# EAGLE schematic v5-CPU-Section-temp (EAGLE 7.5.0)
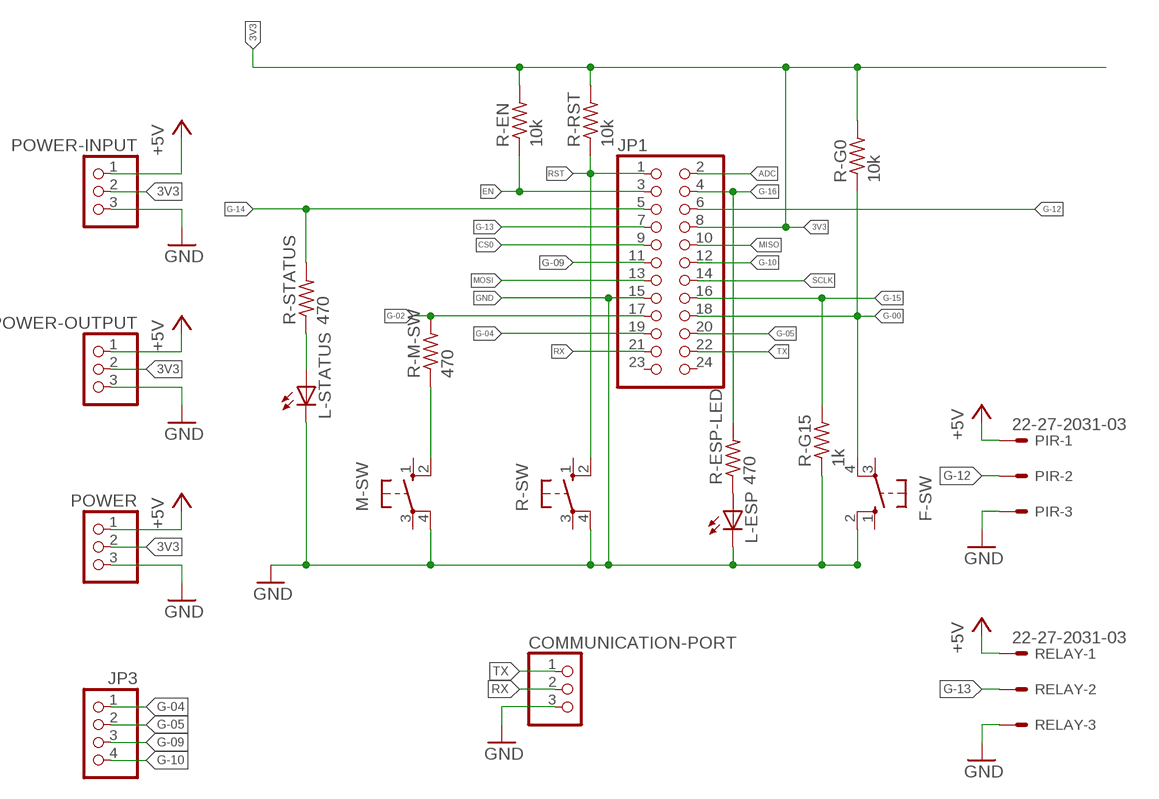
[diagram p0: schematic, sheet 1]

## Parts
COMMUNICATION-PORT  PINHD-1X3  [1X03]
F-SW  10-XX  [B3F-10XX]
JP1  PINHD-2X12  [2X12]
JP3  PINHD-1X4  [1X04]
L-ESP  LED3MM  [LED3MM]
L-STATUS  LED3MM  [LED3MM]
M-SW  10-XX  [B3F-10XX]
PIR  22-27-2031-03  [6410-03]
POWER  PINHD-1X3  [1X03]
POWER-INPUT  PINHD-1X3  [1X03]
POWER-OUTPUT  PINHD-1X3  [1X03]
R-EN  10k  R-US_0207/7  [0207/7]
R-ESP-LED  470  R-US_0207/7  [0207/7]
R-G0  10k  R-US_0207/7  [0207/7]
R-G15  1k  R-US_0207/7  [0207/7]
R-M-SW  470  R-US_0207/7  [0207/7]
R-RST  10k  R-US_0207/7  [0207/7]
R-STATUS  470  R-US_0207/7  [0207/7]
R-SW  10-XX  [B3F-10XX]
RELAY  22-27-2031-03  [6410-03]

## Nets
3V3: JP1.8 POWER-INPUT.2 POWER-OUTPUT.2 POWER.2 R-EN.2 R-G0.2 R-RST.2
+5V: PIR.1 POWER-INPUT.1 POWER-OUTPUT.1 POWER.1 RELAY.1
ADC: JP1.2
CS0: JP1.9
EN: JP1.3 R-EN.1
G-00: F-SW.4(P1) JP1.18 R-G0.1
G-02: JP1.17 R-M-SW.2
G-04: JP1.19 JP3.1
G-05: JP1.20 JP3.2
G-09: JP1.11 JP3.3
G-10: JP1.12 JP3.4
G-12: JP1.6 PIR.2
G-13: JP1.7 RELAY.2
G-14: JP1.5 R-STATUS.2
G-15: JP1.16 R-G15.2
G-16: JP1.4 R-ESP-LED.2
GND: COMMUNICATION-PORT.3 F-SW.2(S1) JP1.15 L-ESP.K(C) L-STATUS.K(C) M-SW.4(P1) PIR.3 POWER-INPUT.3 POWER-OUTPUT.3 POWER.3 R-G15.1 R-SW.4(P1) RELAY.3
MISO: JP1.10
MOSI: JP1.13
N$1: L-STATUS.A R-STATUS.1
N$2: L-ESP.A R-ESP-LED.1
N$11: M-SW.2(S1) R-M-SW.1
RST: JP1.1 R-RST.1 R-SW.2(S1)
RX: COMMUNICATION-PORT.2 JP1.21
SCLK: JP1.14
TX: COMMUNICATION-PORT.1 JP1.22
Unconnected: F-SW.1(S) F-SW.3(P) JP1.23 JP1.24 M-SW.1(S) M-SW.3(P) R-SW.1(S) R-SW.3(P)

## Library data of the parts
COMMUNICATION-PORT POWER POWER-INPUT POWER-OUTPUT = pinhead:PINHD-1X3: PIN HEADER
F-SW M-SW R-SW = switch-omron:10-XX: OMRON SWITCH; MPN: B3F-1000; OC_FARNELL: 176432; OC_NEWARK: 36M3542
JP1 = pinhead:PINHD-2X12: PIN HEADER
JP3 = pinhead:PINHD-1X4: PIN HEADER
L-ESP L-STATUS = led:LED: LED OSRAM: - CHIPLED LG R971, LG N971, LY N971, LG Q971, LY Q971, LO R971, LY R971 LH N974, LH R974 LS Q976, LO Q976, LY Q976 LO Q996 - Hyper CHIPLED LW Q18S LB Q993, LB Q99A, LB R99A - SideLED LS A670, LO A670, LY A670, LG A670, LP A670 LB A673, LV A673, LT A673, LW A673 LH A674 LY A675 LS A676, LA A676, LO A676, LY A676, LW A676 LS A679, LY A679, LG A679 - Hyper Micro SIDELED® LS Y876, LA Y876, LO Y876, LY Y876 LT Y87S - SmartLED LW L88C, LW L88S LB L89C, LB L89S, LG L890 LS L89K, LO L89K, LY L89K LS L896, LA L896, LO L896, LY L896 - TOPLED LS T670, LO T670, LY T670, LG T670, LP T670 LSG T670, LSP T670, LSY T670, LOP T670, LYG T670 LG T671, LOG T671, LSG T671 LB T673, LV T673, LT T673, LW T673 LH T674 LS T676, LA T676, LO T676, LY T676, LB T676, LH T676, LSB T676, LW T676 LB T67C, LV T67C, LT T67C, LS T67K, LO T67K, LY T67K, LW E67C LS E67B, LA E67B, LO E67B, LY E67B, LB E67C, LV E67C, LT E67C LW T67C LS T679, LY T679, LG T679 LS T770, LO T770, LY T770, LG T770, LP T770 LB T773, LV T773, LT T773, LW T773 LH T774 LS E675, LA E675, LY E675, LS T675 LS T776, LA T776, LO T776, LY T776, LB T776 LHGB T686 LT T68C, LB T68C - Hyper Mini TOPLED® LB M676 - Mini TOPLED Santana® LG M470 LS M47K, LO M47K, LY M47K Source: http://www.osram.convergy.de LUXEON: - LUMILED® LXK2-PW12-R00, LXK2-PW12-S00, LXK2-PW14-U00, LXK2-PW14-V00 LXK2-PM12-R00, LXK2-PM12-S00, LXK2-PM14-U00 LXK2-PE12-Q00, LXK2-PE12-R00, LXK2-PE12-S00, LXK2-PE14-T00, LXK2-PE14-U00 LXK2-PB12-K00, LXK2-PB12-L00, LXK2-PB12-M00, LXK2-PB14-N00, LXK2-PB14-P00, LXK2-PB14-Q00 LXK2-PR12-L00, LXK2-PR12-M00, LXK2-PR14-Q00, LXK2-PR14-R00 LXK2-PD12-Q00, LXK2-PD12-R00, LXK2-PD12-S00 LXK2-PH12-R00, LXK2-PH12-S00 LXK2-PL12-P00, LXK2-PL12-Q00, LXK2-PL12-R00 Source: www.luxeon.com KINGBRIGHT: KA-3528ASYC Source: www.kingbright.com
PIR RELAY = con-molex:22-?-03: CONNECTOR wire to board 2.54 mm (.1 inch) pitch header; OC_FARNELL: unknown; OC_NEWARK: unknown
R-EN R-ESP-LED R-G0 R-G15 R-M-SW R-RST R-STATUS = rcl:R-US_: RESISTOR, American symbol